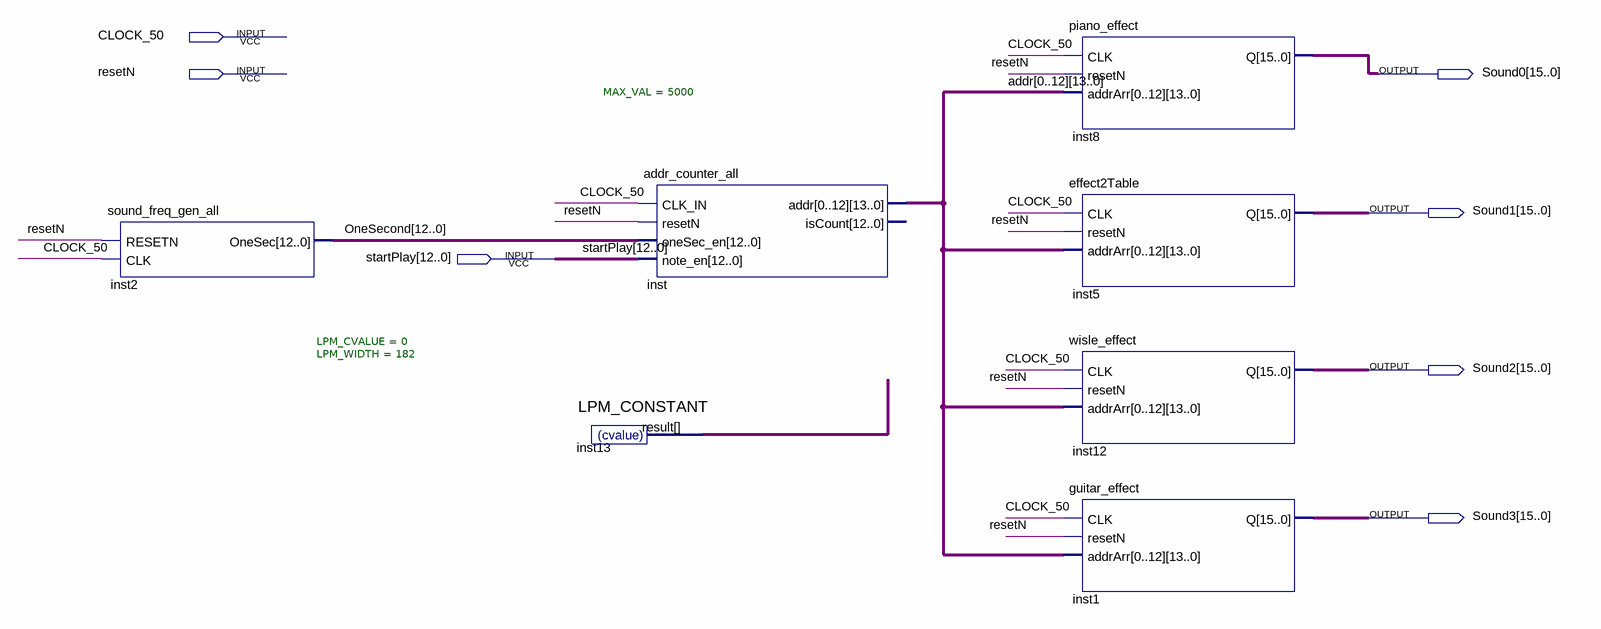
[diagram p0: schematic sheet]
// Quartus schematic notes_top2.bdf as structural Verilog: 7 symbols, 7 pins
module notes_top2 (
  input  CLOCK_50,
  input  resetN,
  input  [12:0] startPlay,
  output [15:0] Sound0,
  output [15:0] Sound1,
  output [15:0] Sound2,
  output [15:0] Sound3
);

  wire [12:0] OneSecond;
  wire [13:0] addr_0, addr_1, addr_2, addr_3, addr_4, addr_5, addr_6, addr_7, addr_8, addr_9, addr_10,
       addr_11, addr_12;
  wire [181:0] inst13_result;

  sound_freq_gen_all inst2 (.RESETN(resetN), .CLK(CLOCK_50), .OneSec(OneSecond));
  LPM_CONSTANT #(.LPM_CVALUE(0), .LPM_WIDTH(182)) inst13 (.result(inst13_result));
  addr_counter_all #(.MAX_VAL(5000)) inst (
    .CLK_IN(CLOCK_50), .resetN(resetN), .oneSec_en(OneSecond), .note_en(startPlay),
    .addr({addr_0, addr_1, addr_2, addr_3, addr_4, addr_5, addr_6, addr_7, addr_8, addr_9, addr_10, addr_11, addr_12}));  // open: isCount
  piano_effect inst8 (
    .CLK(CLOCK_50), .resetN(resetN),
    .addrArr({addr_0, addr_1, addr_2, addr_3, addr_4, addr_5, addr_6, addr_7, addr_8, addr_9, addr_10, addr_11, addr_12}),
    .Q(Sound0));
  effect2Table inst5 (
    .CLK(CLOCK_50), .resetN(resetN),
    .addrArr({addr_0, addr_1, addr_2, addr_3, addr_4, addr_5, addr_6, addr_7, addr_8, addr_9, addr_10, addr_11, addr_12}),
    .Q(Sound1));
  wisle_effect inst12 (
    .CLK(CLOCK_50), .resetN(resetN),
    .addrArr({addr_0, addr_1, addr_2, addr_3, addr_4, addr_5, addr_6, addr_7, addr_8, addr_9, addr_10, addr_11, addr_12}),
    .Q(Sound2));
  guitar_effect inst1 (
    .CLK(CLOCK_50), .resetN(resetN),
    .addrArr({addr_0, addr_1, addr_2, addr_3, addr_4, addr_5, addr_6, addr_7, addr_8, addr_9, addr_10, addr_11, addr_12}),
    .Q(Sound3));
endmodule
